# Altium project Structure_stend.PrjPcb
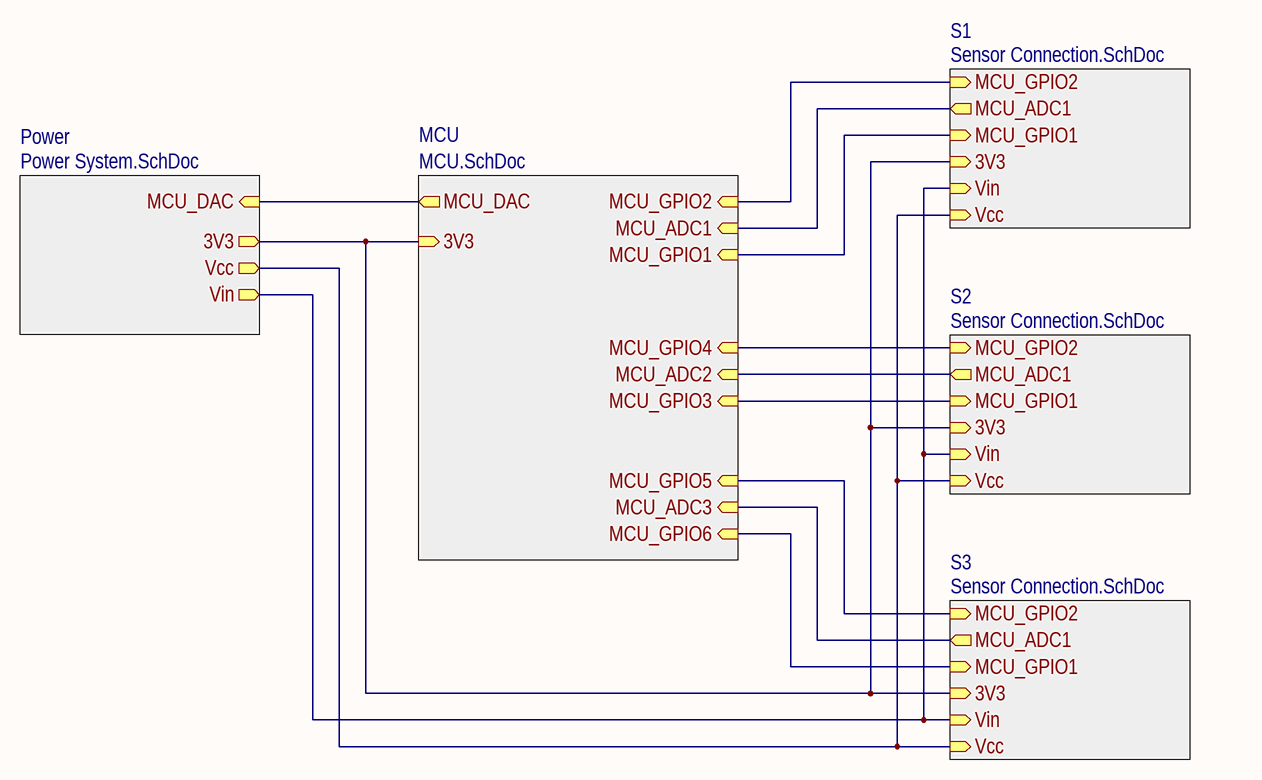
[diagram p0: Stucture.SchDoc]
4 sheets, 100 parts. Net scope: hierarchical (ports join the sheet entries above them; power ports are global).
Board file: VISUR-stend.1.PcbDoc
Sheets:
  Stucture.SchDoc
    MCU = MCU.SchDoc
    Power = Power System.SchDoc
    S1 = Sensor Connection.SchDoc
    S2 = Sensor Connection.SchDoc
    S3 = Sensor Connection.SchDoc

## Sheet Stucture.SchDoc
size 420 x 297 mm; Address1: Address1; Address2: Address2; Address3: Address3; Address4: Address4; DocumentNumber: АБВГ.123456.001 Э3; SheetNumber: 1; Scale: 1:1; DocumentType: Схема электрическая принципиальная; FirstReferrence: АБВГ.123456.001

### Sub-sheets
MCU = MCU.SchDoc: MCU_GPIO5 (in), MCU_GPIO6 (in), MCU_GPIO4 (in), MCU_ADC3 (in), MCU_GPIO1 (in), MCU_ADC1 (in), MCU_ADC2 (in), MCU_DAC (out), 3V3 (in), MCU_GPIO2 (in), MCU_GPIO3 (in)
Power = Power System.SchDoc: MCU_DAC (in), Vcc (out), 3V3 (out), Vin (out)
S1 = Sensor Connection.SchDoc: MCU_GPIO2 (in), MCU_ADC1 (out), MCU_GPIO1 (in), Vcc (in), 3V3 (in), Vin (in)
S2 = Sensor Connection.SchDoc: MCU_GPIO2 (in), MCU_ADC1 (out), MCU_GPIO1 (in), Vcc (in), 3V3 (in), Vin (in)
S3 = Sensor Connection.SchDoc: MCU_GPIO2 (in), MCU_ADC1 (out), MCU_GPIO1 (in), Vcc (in), 3V3 (in), Vin (in)

### Nets
3V3: sheet MCU/3V3, sheet Power/3V3, sheet S1/3V3, sheet S2/3V3, sheet S3/3V3
Vin: sheet Power/Vin, sheet S1/Vin, sheet S2/Vin, sheet S3/Vin
NetC5_2: sheet Power/Vcc, sheet S1/Vcc, sheet S2/Vcc, sheet S3/Vcc
NetDA1_S1_1: sheet MCU/MCU_ADC1, sheet S1/MCU_ADC1
NetDA1_S2_1: sheet MCU/MCU_ADC2, sheet S2/MCU_ADC1
NetDA1_S3_1: sheet MCU/MCU_ADC3, sheet S3/MCU_ADC1
NetDD7_10: sheet MCU/MCU_DAC, sheet Power/MCU_DAC
NetDD7_17: sheet MCU/MCU_GPIO6, sheet S3/MCU_GPIO1
NetDD7_18: sheet MCU/MCU_GPIO5, sheet S3/MCU_GPIO2
NetDD7_19: sheet MCU/MCU_GPIO4, sheet S2/MCU_GPIO2
NetDD7_20: sheet MCU/MCU_GPIO3, sheet S2/MCU_GPIO1
NetDD7_21: sheet MCU/MCU_GPIO2, sheet S1/MCU_GPIO2
NetDD7_22: sheet MCU/MCU_GPIO1, sheet S1/MCU_GPIO1

### Notes on the sheet
- Перв. примен.
- Справ. №
- Подп. и дата
- Инв. № дубл.
- Взам. инв. №
- Разраб.
- Изм.
- Лист
- № докум.
- Подп.
- Дата
- Лит.
- Масса
- Масштаб
- Пров.
- Т.контр.
- Листов
- Инв. № подл.
- Утв.
- Н.контр.
- 2.106-A3
- Копировал
- Формат А3

## Sheet MCU.SchDoc
size 420 x 297 mm; Address1: Address1; Address2: Address2; Address3: Address3; Address4: Address4; DocumentNumber: АБВГ.123456.001 Э3; SheetNumber: 1; Scale: 1:1; DocumentType: Схема электрическая принципиальная; FirstReferrence: АБВГ.123456.001
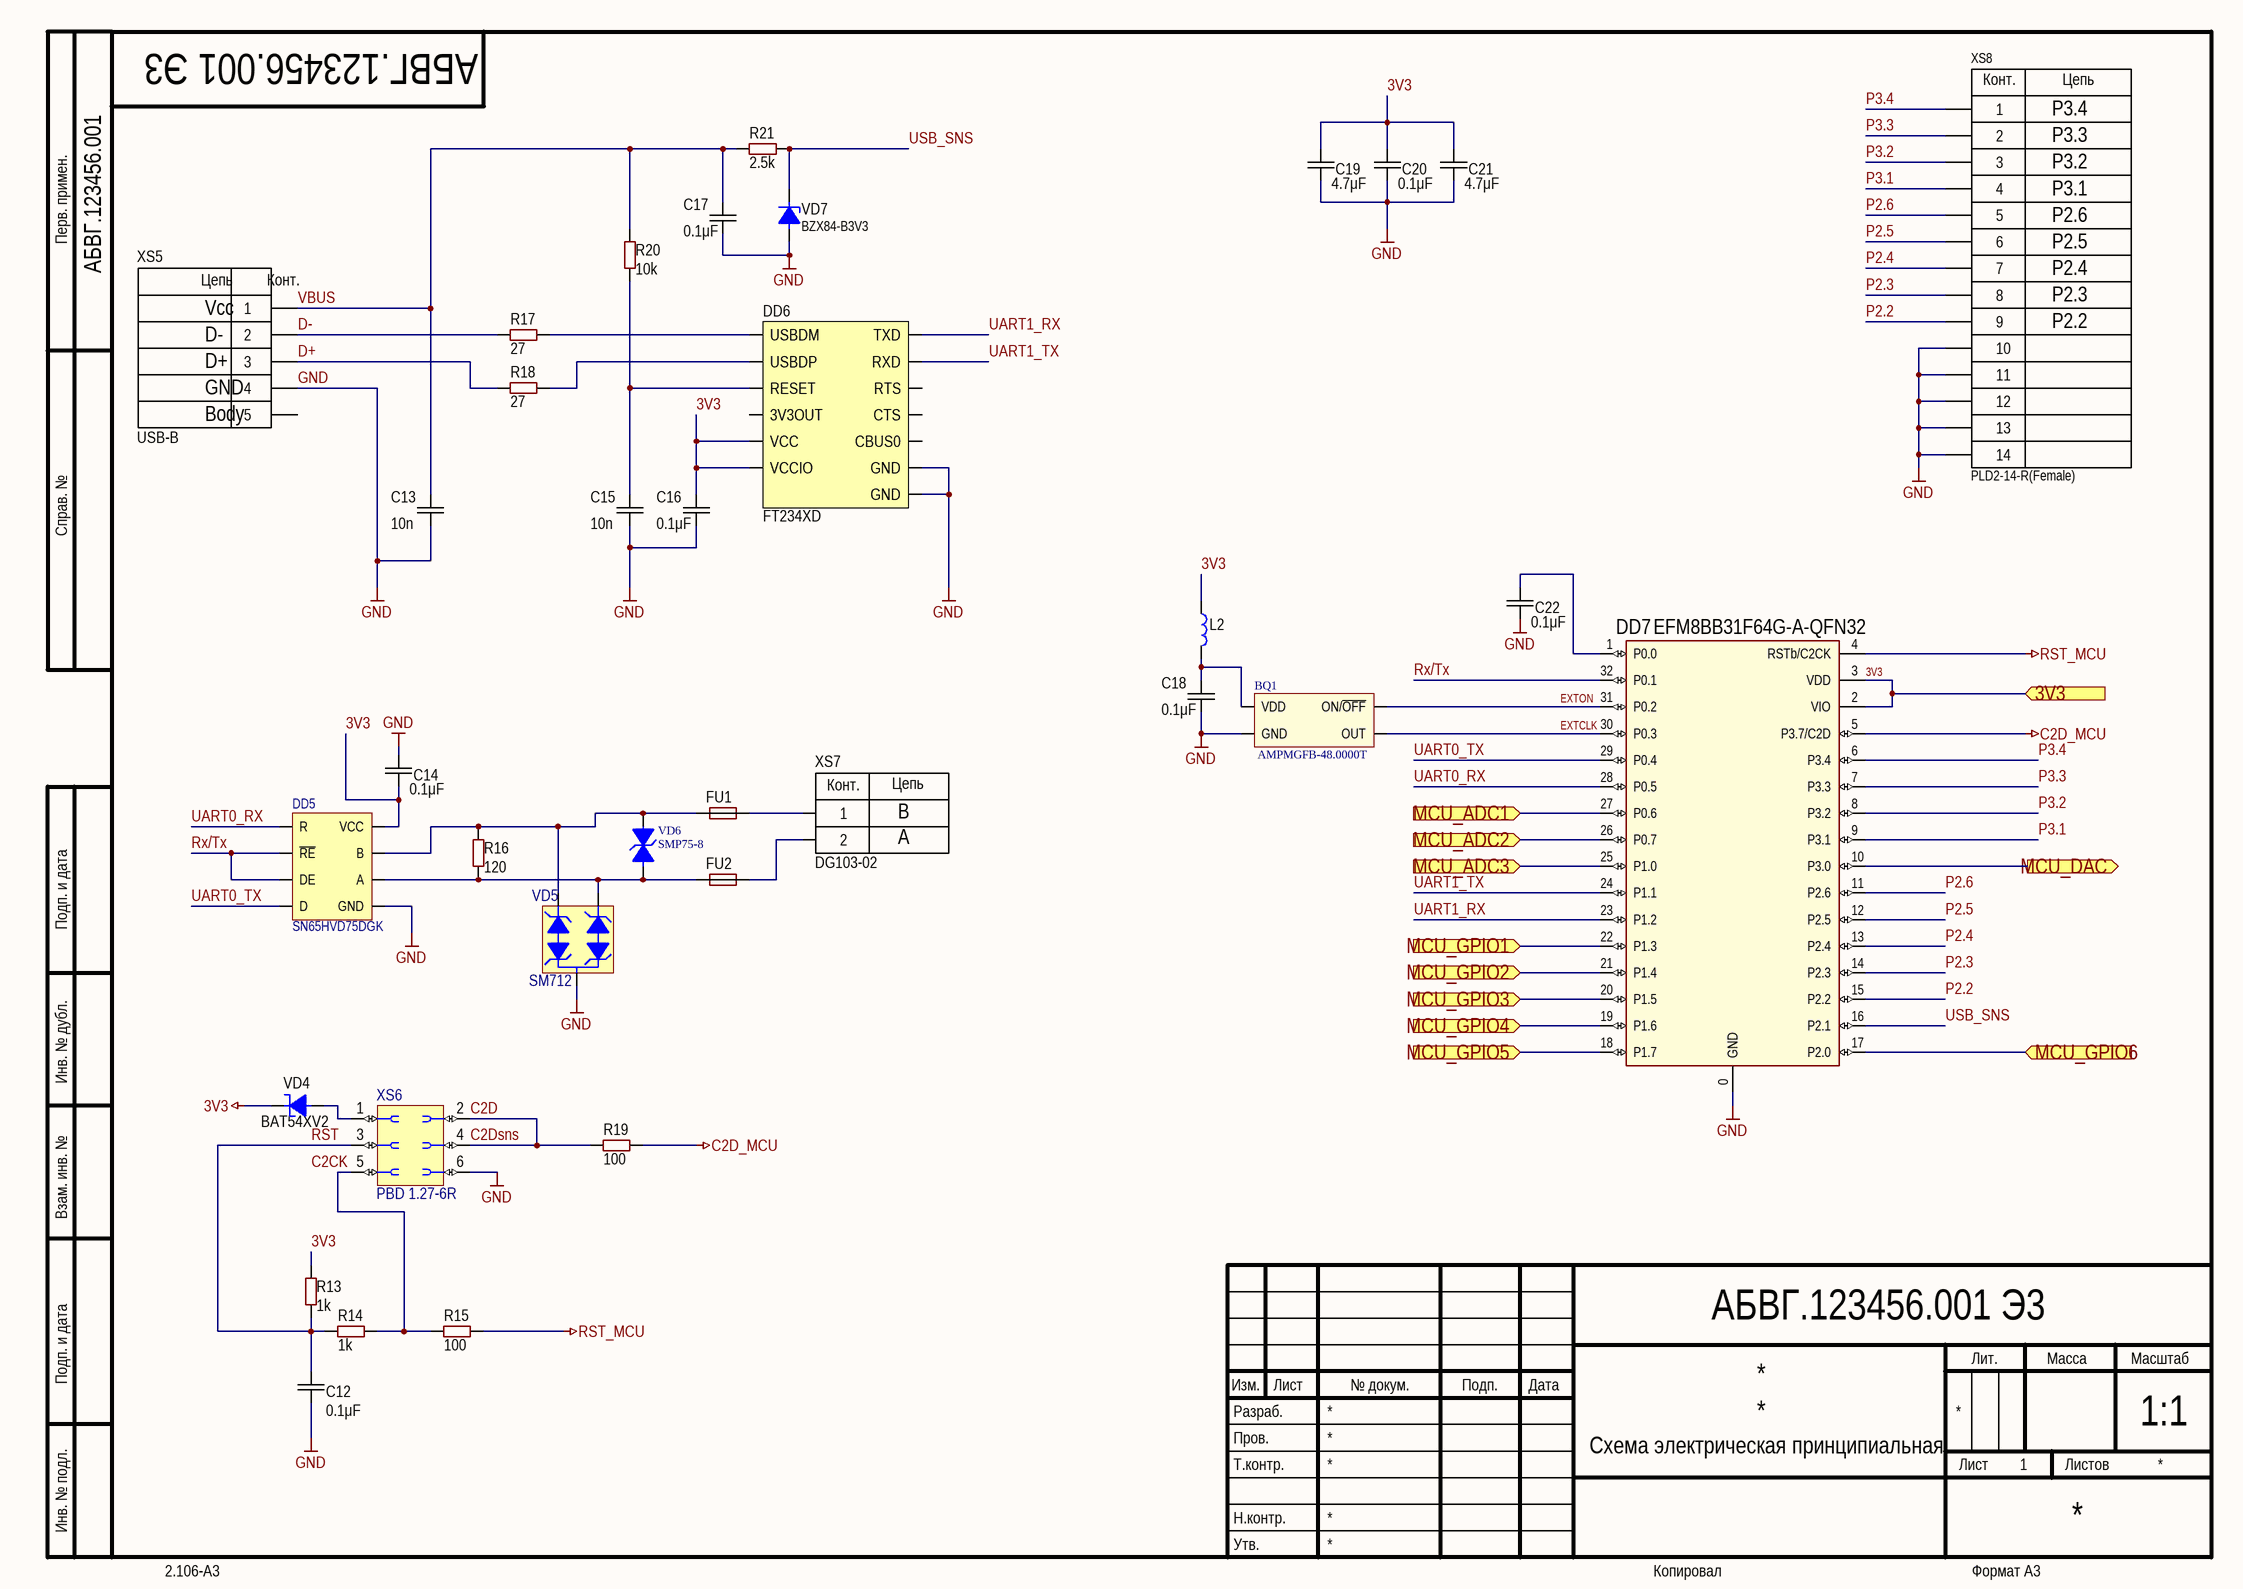
[diagram p1: MCU.SchDoc]

### Parts
BQ1  AMPMGFB-48.0000T  [AMPMGFB(1.6x1.2)]
C12  value 0.1μF  [CAP: 0603]
C13  value 10n  [CAP: 0603]
C14  value 0.1μF  [CAP: 0603]
C15  value 10n  [CAP: 0603]
C16  value 0.1μF  [CAP: 0603]
C17  value 0.1μF  [CAP: 0603]
C18  value 0.1μF  [CAP: 0603]
C19  value 4.7μF  [CAP: 0603]
C20  value 0.1μF  [CAP: 0603]
C21  value 4.7μF  [CAP: 0603]
C22  value 0.1μF  [CAP: 0603]
DD5  SN65HVD75DGK  [VSSOP-8]
DD6  FT234XD  [12-DFN]
DD7  EFM8BB31F64G-A-QFN32  [32-QFN(4x4)]
FU1  (no value)  [FUSE: 0603]
FU2  (no value)  [FUSE: 0603]
L2  BLM18AG102SN1D  [IND: 0603]  (value not drawn)
R13  value 1k  [RES: 0603]
R14  value 1k  [RES: 0603]
R15  value 100  [RES: 0603]
R16  value 120  [RES: 0603]
R17  value 27  [RES: 0603]
R18  value 27  [RES: 0603]
R19  value 100  [RES: 0603]
R20  value 10k  [RES: 0603]
R21  value 2.5k  [RES: 0603]
VD4  PartNumber: BAT54XV2  [DIODE: SOD523]
VD5  SM712  [SOT23]
VD6  SMP75-8  [DIODE: SMB]
VD7  BZX84-B3V3  [SOT23]
XS5  USB-B  [CON: USB-B(Female vertical)]
XS6  PBD 1.27-6R  [CON: PLLD-6R(1.27)]
XS7  DG103-02  [DG103-02]
XS8  PLD2-14-R(Female)  [CON: PLD2-14-R(Female)]

### Ports
3V3 (in), MCU_ADC1 (in), MCU_ADC2 (in), MCU_ADC3 (in), MCU_DAC (out), MCU_GPIO1 (in), MCU_GPIO2 (in), MCU_GPIO3 (in), MCU_GPIO4 (in), MCU_GPIO5 (in), MCU_GPIO6 (in)

### Nets
3V3: C14.1 C16.2 C19.2 C20.2 C21.2 DD5.8(VCC) DD6.4(VCC) DD6.9(VCCIO) DD7.2(VIO) DD7.3(VDD) L2.1 R13.1 VD4.2 ; port 3V3
C2D_MCU: DD7.5(P3.7/C2D) R19.1
GND: BQ1.2(GND) C12.1 C13.1 C14.2 C15.1 C16.1 C17.1 C18.1 C19.1 C20.1 C21.1 C22.1 DD5.5(GND) DD6.5(GND) DD6.13(GND) DD7.0(GND) VD5.3 VD7.1 XS5.4 XS6.6 XS8.10 XS8.11 XS8.12 XS8.13 XS8.14
RST_MCU: DD7.4(RSTb/C2CK) R15.2
C2D: R19.2 XS6.2 XS6.4  [also labelled C2Dsns]
D+: R18.2 XS5.3
D-: R17.2 XS5.2
EXTCLK: BQ1.3(OUT) DD7.30(P0.3)
EXTON: BQ1.1(ON/~{OFF}) DD7.31(P0.2)
P2.2: DD7.15(P2.2) XS8.9
P2.3: DD7.14(P2.3) XS8.8
P2.4: DD7.13(P2.4) XS8.7
P2.5: DD7.12(P2.5) XS8.6
P2.6: DD7.11(P2.6) XS8.5
P3.1: DD7.9(P3.1) XS8.4
P3.2: DD7.8(P3.2) XS8.3
P3.3: DD7.7(P3.3) XS8.2
P3.4: DD7.6(P3.4) XS8.1
RST: C12.2 R13.2 R14.1 XS6.3
Rx/Tx: DD5.2(~{RE}) DD5.3(DE) DD7.32(P0.1)
UART0_RX: DD5.1(R) DD7.28(P0.5)
UART0_TX: DD5.4(D) DD7.29(P0.4)
UART1_RX: DD6.7(TXD) DD7.23(P1.2)
UART1_TX: DD6.10(RXD) DD7.24(P1.1)
USB_SNS: DD7.16(P2.1) R21.1 VD7.2
VBUS: C13.2 C17.2 R20.2 R21.2 XS5.1
NetBQ1_4: BQ1.4(VDD) C18.2 L2.2
NetC15_2: C15.2 DD6.2(RESET) R20.1
NetC22_2: C22.2 DD7.1(P0.0)
NetDA1_S1_1: DD7.27(P0.6) ; port MCU_ADC1
NetDA1_S2_1: DD7.26(P0.7) ; port MCU_ADC2
NetDA1_S3_1: DD7.25(P1.0) ; port MCU_ADC3
NetDD5_6: DD5.6(A) FU2.1 R16.1 VD5.2 VD6.1
NetDD5_7: DD5.7(B) FU1.1 R16.2 VD5.1 VD6.2
NetDD6_1: DD6.1(USBDM) R17.1
NetDD6_12: DD6.12(USBDP) R18.1
NetDD7_10: DD7.10(P3.0) ; port MCU_DAC
NetDD7_17: DD7.17(P2.0) ; port MCU_GPIO6
NetDD7_18: DD7.18(P1.7) ; port MCU_GPIO5
NetDD7_19: DD7.19(P1.6) ; port MCU_GPIO4
NetDD7_20: DD7.20(P1.5) ; port MCU_GPIO3
NetDD7_21: DD7.21(P1.4) ; port MCU_GPIO2
NetDD7_22: DD7.22(P1.3) ; port MCU_GPIO1
NetFU1_2: FU1.2 XS7.1
NetFU2_2: FU2.2 XS7.2
NetR14_2: R14.2 R15.1 XS6.5
NetVD4_1: VD4.1 XS6.1

Not connected (* = marked no-connect by the designer): DD6 3(3V3OUT) 6(CBUS0) 8(RTS) 11(CTS); XS5 5

### Notes on the sheet
- P3.4
- P3.2
- P3.3
- P2.5
- P2.6
- P3.1
- P2.2
- P2.3
- P2.4
- B
- A
- Labels drawn without touching a wire or pin: C2CK
- Перв. примен.
- Справ. №
- Подп. и дата
- Инв. № дубл.
- Взам. инв. №
- Разраб.
- Изм.
- Лист
- № докум.
- Подп.
- Дата
- Лит.
- Масса
- Масштаб
- Пров.
- Т.контр.
- Листов
- Инв. № подл.
- Утв.
- Н.контр.
- 2.106-A3
- Копировал
- Формат А3
- (in symbol DG103-02) Конт.; Цепь
- (in symbol PLD2-14(Female)) Конт.; Цепь
- (in symbol USB-B) Цепь; Конт.; Vcc; D-; D+; GND; Body

### Library data of the parts
C12 C14 C16-C18 C20 C22 = Ceramic_0603: Manufacturer: Yageo; PartNumber: CC0603KRX7R7BB104; ValueManufacturerPartNumber: Ceramic capacitor, 0.1μF, X7R, ±10%, 16V, 0603, -55...+125°C; TypeCapacitor: Ceramic capacitor; Tolerance: ±10%; TypeDielectric: X7R; Voltage: 16V; Package: 0603; HelpURL: https://www.digikey.com/product-detail/en/yageo/CC0603KRX7R7BB104/311-1088-1-ND/302998; Temperature: -55...+125°C
C13 C15 = Ceramic_0603: Manufacturer: Yageo; PartNumber: CC0603KRX7R7BB104; ValueManufacturerPartNumber: Ceramic capacitor, 10n, X7R, ±10%, 16V, 0603, -55...+125°C; TypeCapacitor: Ceramic capacitor; Tolerance: ±10%; TypeDielectric: X7R; Voltage: 16V; Package: 0603; HelpURL: https://www.digikey.com/product-detail/en/yageo/CC0603KRX7R7BB104/311-1088-1-ND/302998; Temperature: -55...+125°C
C19 C21 = Ceramic_0603: Manufacturer: Yageo; PartNumber: CC0603KRX7R7BB104; ValueManufacturerPartNumber: Ceramic capacitor, 4.7μF, X7R, ±10%, 16V, 0603, -55...+125°C; TypeCapacitor: Ceramic capacitor; Tolerance: ±10%; TypeDielectric: X7R; Voltage: 16V; Package: 0603; HelpURL: https://www.digikey.com/product-detail/en/yageo/CC0603KRX7R7BB104/311-1088-1-ND/302998; Temperature: -55...+125°C
DD5 = SN65HVD72DGK: RS-485/422; ComponentLink1Description: Datasheet; ComponentLink1URL: https://www.ti.com/lit/ds/symlink/sn65hvd72.pdf?ts=1607084930164&ref_url=https%253A%252F%252Fwww.ti.com%252Fstore%252Fti%252Fen%252Fp%252Fproduct%252F%253Fp%253DSN65HVD72DRBT
DD6 = FT234XD: USB-UART; ComponentLink1Description: Datasheet; ComponentLink1URL: https://ftdichip.com/wp-content/uploads/2020/08/DS_FT234XD.pdf
DD7 = EFM8BB31F64G-A-QFN32: 8051 MCU Core
FU1 FU2 = Fuse: Manufacturer: Littelfuse; PartNumber: 01110501Z; TypeFuse: Electromechanics relay; VoltageMax: 250VAC; Package: 5x20mm; HelpURL: https://www.digikey.com/products/en?keywords=01110501Z; ValueManufacturerPartNumber: =TypeFuse+', '+VoltageMax+', '+MaxCurrent+', '+Package+', '+Temperature
L2 = BLM18AG102SN1D: 100MHz 1K
R13 R14 = Resistor_0603: Manufacturer: Yageo; PartNumber: RC0603JR-07100RL; ValueManufacturerPartNumber: Resistor film, 1k, ±5%, 0603, 0.1W, -55...+125°C; TypeResistor: Resistor film; Power: 0.1W; Tolerance: ±5%; Package: 0603; HelpURL: https://www.digikey.com/product-detail/en/yageo/RC0603JR-07100RL/311-100GRCT-ND/729644; Temperature: -55...+125°C
R15 R19 = Resistor_0603: Manufacturer: Yageo; PartNumber: RC0603JR-07100RL; ValueManufacturerPartNumber: Resistor film, 100, ±5%, 0603, 0.1W, -55...+125°C; TypeResistor: Resistor film; Power: 0.1W; Tolerance: ±5%; Package: 0603; HelpURL: https://www.digikey.com/product-detail/en/yageo/RC0603JR-07100RL/311-100GRCT-ND/729644; Temperature: -55...+125°C
R16 = Resistor_0603: Manufacturer: Yageo; PartNumber: RC0603JR-07100RL; ValueManufacturerPartNumber: Resistor film, 120, ±5%, 0603, 0.1W, -55...+125°C; TypeResistor: Resistor film; Power: 0.1W; Tolerance: ±5%; Package: 0603; HelpURL: https://www.digikey.com/product-detail/en/yageo/RC0603JR-07100RL/311-100GRCT-ND/729644; Temperature: -55...+125°C
R17 R18 = Resistor_0603: Manufacturer: Yageo; PartNumber: RC0603JR-07100RL; ValueManufacturerPartNumber: Resistor film, 27, ±5%, 0603, 0.1W, -55...+125°C; TypeResistor: Resistor film; Power: 0.1W; Tolerance: ±5%; Package: 0603; HelpURL: https://www.digikey.com/product-detail/en/yageo/RC0603JR-07100RL/311-100GRCT-ND/729644; Temperature: -55...+125°C
R20 = Resistor_0603: Manufacturer: Yageo; PartNumber: RC0603JR-07100RL; ValueManufacturerPartNumber: Resistor film, 10k, ±5%, 0603, 0.1W, -55...+125°C; TypeResistor: Resistor film; Power: 0.1W; Tolerance: ±5%; Package: 0603; HelpURL: https://www.digikey.com/product-detail/en/yageo/RC0603JR-07100RL/311-100GRCT-ND/729644; Temperature: -55...+125°C
R21 = Resistor_0603: Manufacturer: Yageo; PartNumber: RC0603JR-07100RL; ValueManufacturerPartNumber: Resistor film, 2.5k, ±5%, 0603, 0.1W, -55...+125°C; TypeResistor: Resistor film; Power: 0.1W; Tolerance: ±5%; Package: 0603; HelpURL: https://www.digikey.com/product-detail/en/yageo/RC0603JR-07100RL/311-100GRCT-ND/729644; Temperature: -55...+125°C
VD4 = Schottky_single: Manufacturer: Diodes Incorporated; ValueManufacturerPartNumber: Schottky diode, 80V, 500mA, 1V, 15pF, SOD-123, -55...+150°C; TypeDiode: Schottky diode; Voltage: 80V; Current: 500mA; VoltageDrop: 1V; RecoveryTime: 15pF; Package: SOD-123; HelpURL: https://www.digikey.com/product-detail/en/diodes-incorporated/MBR0580S1-7/MBR0580S1-7DICT-ND/5080371; Temperature: -55...+150°C
VD5 = SM712: EIA RS-485 ±7V ±12V
VD6 = SMBJ10CA-TR
XS8 = PLD2-14(Female): ComponentLink1Description: Datasheet; ComponentLink1URL: https://www.compel.ru/item-pdf/1e1366ded138976aeb89dd182fa987b9/ps/kls~kls1-207b.pdf
VD7 = BZX84-B3V3: ComponentLink1Description: Datasheet; ComponentLink1URL: https://www.nexperia.com/products/diodes/automotive-diodes/automotive-zener-diodes/BZX84-B3V3.html
XS5 = USB-B: ComponentLink1Description: Datasheet; ComponentLink1URL: https://www.sparkfun.com/datasheets/Prototyping/USB-B%20Connector.pdf; ComponentLink2Description: Datasheet(vertical); ComponentLink2URL: https://app.adam-tech.com/products/download/data_sheet/195855/usb-b-s-vt-data-sheet.pdf

## Sheet Power System.SchDoc
size 420 x 297 mm; Address1: Address1; Address2: Address2; Address3: Address3; Address4: Address4; DocumentNumber: АБВГ.123456.001 Э3; SheetNumber: 1; Scale: 1:1; DocumentType: Схема электрическая принципиальная; FirstReferrence: АБВГ.123456.001
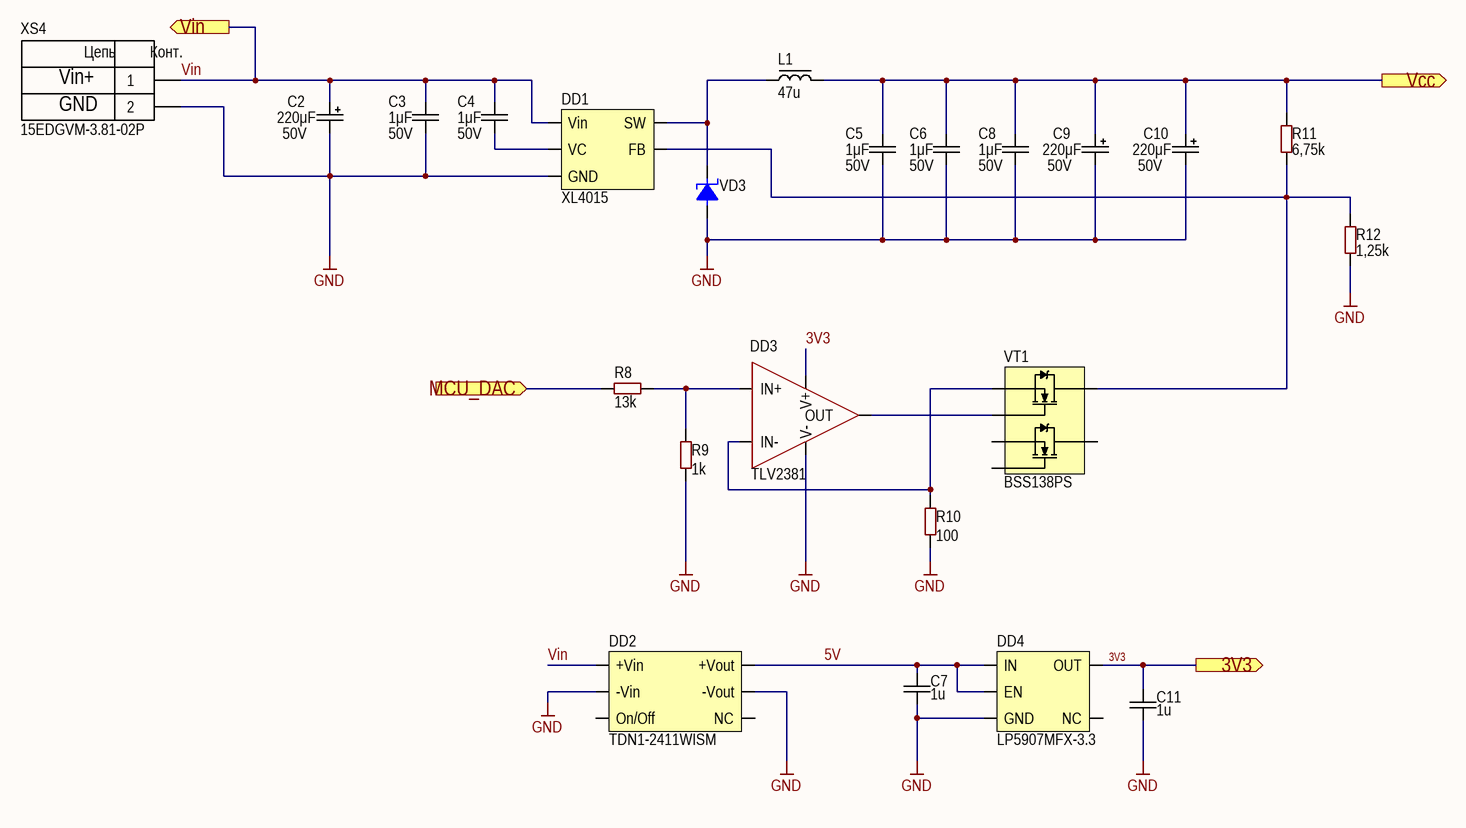
[diagram p2: Power System.SchDoc]

### Parts
C2  value 220μF  Voltage: 50V  [CAP: SMD-G Package(10x10)]
C3  value 1μF  Voltage: 50V  [CAP: 0805]
C4  value 1μF  Voltage: 50V  [CAP: 0805]
C5  value 1μF  Voltage: 50V  [CAP: 0805]
C6  value 1μF  Voltage: 50V  [CAP: 0805]
C7  value 1u  [CAP: 0603]
C8  value 1μF  Voltage: 50V  [CAP: 0805]
C9  value 220μF  Voltage: 50V  [CAP: SMD-G Package(10x10)]
C10  value 220μF  Voltage: 50V  [CAP: SMD-G Package(10x10)]
C11  value 1u  [CAP: 0603]
DD1  XL4015  [TO263-5L]
DD2  TDN1-2411WISM  [TDN1-2411WISM]
DD3  TLV2381  [SOT23-5]
DD4  LP5907MFX-3.3  [SOT23-5]
L1  47u  [IND: HM]
R8  value 13k  [RES: 0603]
R9  value 1k  [RES: 0603]
R10  value 100  [RES: 0603]
R11  value 6,75k  [RES: 0603]
R12  value 1,25k  [RES: 0603]
VD3  STPS1045DEE  [PowerFLAT(3.3x3.3)]  (value not drawn)
VT1  BSS138PS  [SOT363]
XS4  15EDGVM-3.81-02P  [CON: 15EDGVM-3.81-02P]

### Ports
3V3 (out), MCU_DAC (in), Vcc (out), Vin (out)

### Nets
3V3: C11.2 DD3.5(V+) DD4.5(OUT) ; port 3V3
GND: C2.2 C3.1 C5.1 C6.1 C7.1 C8.1 C9.2 C10.2 C11.1 DD1.1(GND) DD2.2(-Vin) DD2.6(-Vout) DD3.2(V-) DD4.2(GND) R9.2 R10.2 R12.1 VD3.1 XS4.2
5V: C7.2 DD2.7(+Vout) DD4.1(IN) DD4.3(EN)
Vin: C2.1 C3.2 C4.2 DD1.5(Vin) DD2.1(+Vin) XS4.1 ; port Vin
NetC4_1: C4.1 DD1.4(VC)
NetC5_2: C5.2 C6.2 C8.2 C9.1 C10.1 L1.2 R11.2 ; port Vcc
NetDD1_2: DD1.2(FB) R11.1 R12.2 VT1.6(D1)
NetDD1_3: DD1.3(SW) L1.1 VD3.2
NetDD3_1: DD3.1(OUT) VT1.2(G1)
NetDD3_3: DD3.3(IN+) R8.1 R9.1
NetDD3_4: DD3.4(IN-) R10.1 VT1.1(S1)
NetDD7_10: R8.2 ; port MCU_DAC

Not connected (* = marked no-connect by the designer): DD2 4(On/Off) 5(NC); DD4 4(NC); VT1 3(D2) 4(S2) 5(G2)

### Notes on the sheet
- (near XS4) Vin+
- GND
- Перв. примен.
- Справ. №
- Подп. и дата
- Инв. № дубл.
- Взам. инв. №
- Разраб.
- Изм.
- Лист
- № докум.
- Подп.
- Дата
- Лит.
- Масса
- Масштаб
- Пров.
- Т.контр.
- Листов
- Инв. № подл.
- Утв.
- Н.контр.
- 2.106-A3
- Копировал
- Формат А3
- (in symbol 15EDGVM-3.81-02P) Цепь; Конт.

### Library data of the parts
C2 C9 C10 = Aluminium
C3-C6 C8 = Ceramic_0805: Manufacturer: Yageo; PartNumber: CC0805KRX7R7BB104; ValueManufacturerPartNumber: Ceramic capacitor, 1μF, X7R, ±10%, 50V, 0805, -55...+125°C; TypeCapacitor: Ceramic capacitor; Tolerance: ±10%; TypeDielectric: X7R; Package: 0805; HelpURL: https://www.digikey.com/product-detail/en/yageo/CC0805KRX7R7BB104/311-1142-1-ND/303052; Temperature: -55...+125°C
C7 C11 = Ceramic_0603: Manufacturer: Yageo; PartNumber: CC0603KRX7R7BB104; ValueManufacturerPartNumber: Ceramic capacitor, 1u, X7R, ±10%, 16V, 0603, -55...+125°C; TypeCapacitor: Ceramic capacitor; Tolerance: ±10%; TypeDielectric: X7R; Voltage: 16V; Package: 0603; HelpURL: https://www.digikey.com/product-detail/en/yageo/CC0603KRX7R7BB104/311-1088-1-ND/302998; Temperature: -55...+125°C
DD1 = XL4015: Buck DC-DC; ComponentLink1Description: Datasheet; ComponentLink1URL: http://www.xlsemi.com/datasheet/xl4015%20datasheet.pdf
DD2 = TDN1-2411WISM: DC-DC converter; ComponentLink1Description: Datasheet; ComponentLink1URL: https://www.tracopower.com/int/ru/model/tdn-1-2411wism
DD3 = TLV2381: OPAmp; ComponentLink1Description: Datasheet; ComponentLink1URL: https://www.ti.com/lit/ds/symlink/tlv2382.pdf?ts=1631189776503&ref_url=https%253A%252F%252Fwww.google.com%252F
DD4 = LP5907MFX-3.3: LDO 250 mA; ComponentLink1Description: Datasheet; ComponentLink1URL: https://www.ti.com/lit/ds/symlink/lp5907.pdf?ts=1629438025263&ref_url=https%253A%252F%252Fwww.google.com%252F
L1 = Inductor(HM)
R8 = Resistor_0603: Manufacturer: Yageo; PartNumber: RC0603JR-07100RL; ValueManufacturerPartNumber: Resistor film, 13k, ±5%, 0603, 0.1W, -55...+125°C; TypeResistor: Resistor film; Power: 0.1W; Tolerance: ±5%; Package: 0603; HelpURL: https://www.digikey.com/product-detail/en/yageo/RC0603JR-07100RL/311-100GRCT-ND/729644; Temperature: -55...+125°C
R9 = Resistor_0603: as R13 on sheet MCU; Package: 0603; HelpURL: https://www.digikey.com/product-detail/en/yageo/RC0603JR-07100RL/311-100GRCT-ND/729644; Temperature: -55...+125°C
R10 = Resistor_0603: as R15 on sheet MCU; Package: 0603; HelpURL: https://www.digikey.com/product-detail/en/yageo/RC0603JR-07100RL/311-100GRCT-ND/729644; Temperature: -55...+125°C
R11 = Resistor_0603: Manufacturer: Yageo; PartNumber: RC0603JR-07100RL; ValueManufacturerPartNumber: Resistor film, 6,75k, ±5%, 0603, 0.1W, -55...+125°C; TypeResistor: Resistor film; Power: 0.1W; Tolerance: ±5%; Package: 0603; HelpURL: https://www.digikey.com/product-detail/en/yageo/RC0603JR-07100RL/311-100GRCT-ND/729644; Temperature: -55...+125°C
R12 = Resistor_0603: Manufacturer: Yageo; PartNumber: RC0603JR-07100RL; ValueManufacturerPartNumber: Resistor film, 1,25k, ±5%, 0603, 0.1W, -55...+125°C; TypeResistor: Resistor film; Power: 0.1W; Tolerance: ±5%; Package: 0603; HelpURL: https://www.digikey.com/product-detail/en/yageo/RC0603JR-07100RL/311-100GRCT-ND/729644; Temperature: -55...+125°C
VD3 = STPS1045DEE: 45V,10A Schottky; ComponentLink1Description: Datasheet; ComponentLink1URL: https://www.st.com/en/diodes-and-rectifiers/stps1045dee.html
VT1 = BSS138PS: ComponentLink1Description: Datasheet; ComponentLink1URL: https://assets.nexperia.com/documents/data-sheet/BSS138PS.pdf
XS4 = 15EDGVM-3.81-02P: ComponentLink1Description: Datasheet; ComponentLink1URL: http://files.xn--e1agecchai.xn--p1ai/pdf/15edgvm-3.81.pdf

## Sheet Sensor Connection.SchDoc
size 420 x 297 mm; Address1: Address1; Address2: Address2; Address3: Address3; Address4: Address4; DocumentNumber: АБВГ.123456.001 Э3; SheetNumber: 1; Scale: 1:1; DocumentType: Схема электрическая принципиальная; FirstReferrence: АБВГ.123456.001
Used 3 times, as channels S1, S2, S3. Parts and nets are listed once, with the designators drawn on the sheet.
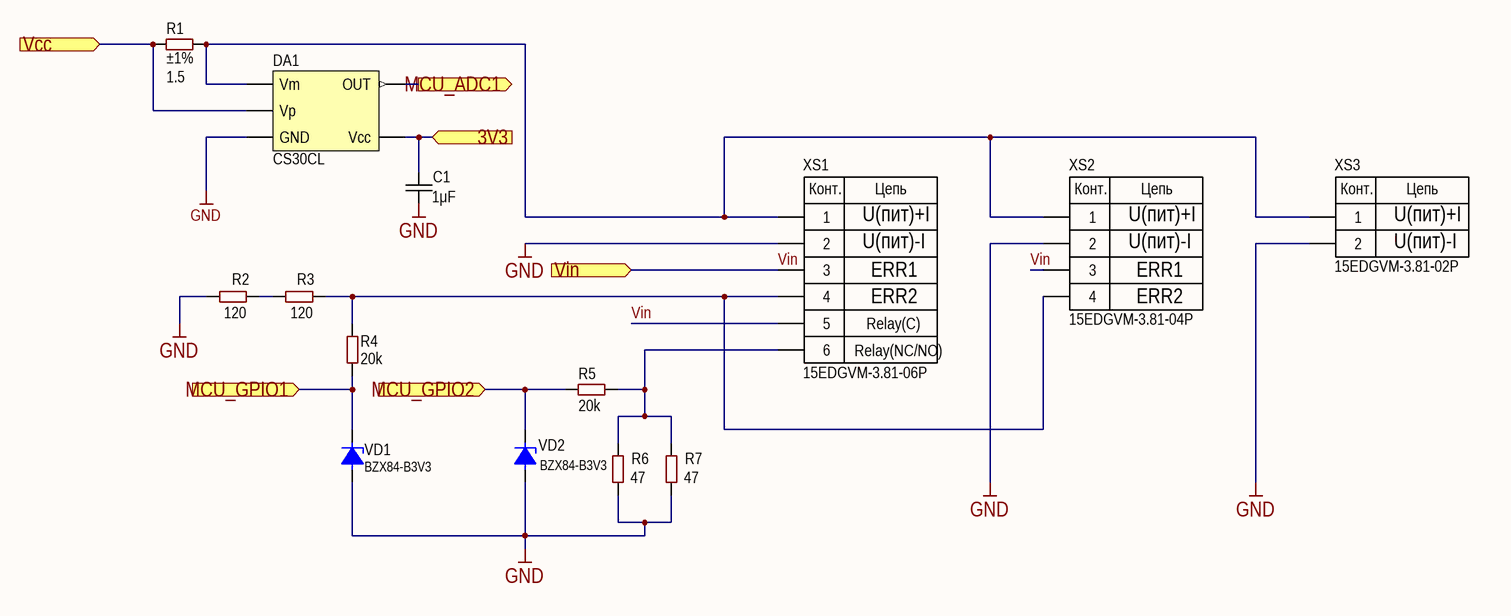
[diagram p3: Sensor Connection.SchDoc]

### Parts
C1  value 1μF  [CAP: 0603]
DA1  CS30CL  [SOT23-5]
R1  value 1.5  Tolerance: ±1%  [RES: 2512]
R2  120  [MFR-2W]
R3  120  [MFR-2W]
R4  value 20k  [RES: 0603]
R5  value 20k  [RES: 0603]
R6  47  [SQP-10]
R7  47  [SQP-10]
VD1  BZX84-B3V3  [SOT23]
VD2  BZX84-B3V3  [SOT23]
XS1  15EDGVM-3.81-06P  [CON: 15EDGVM-3.81-06P]
XS2  15EDGVM-3.81-04P  [CON: 15EDGVM-3.81-04P]
XS3  15EDGVM-3.81-02P  [CON: 15EDGVM-3.81-02P]

### Ports
3V3 (in), MCU_ADC1 (out), MCU_GPIO1 (in), MCU_GPIO2 (in), Vcc (in), Vin (in)

### Nets
GND: C1.1 DA1.2(GND) R2.1 R6.1 R7.1 VD1.1 VD2.1 XS1.2 XS2.2 XS3.2
3V3: C1.2 DA1.5(Vcc) ; port 3V3
MCU_ADC1: DA1.1(OUT) ; port MCU_ADC1
MCU_GPIO1: R4.1 VD1.2 ; port MCU_GPIO1
MCU_GPIO2: R5.1 VD2.2 ; port MCU_GPIO2
Vcc: DA1.3(Vp) R1.1 ; port Vcc
Vin: XS1.3 XS1.5 XS2.3 ; port Vin
NetDA1_4: DA1.4(Vm) R1.2 XS1.1 XS2.1 XS3.1
NetR2_2: R2.2 R3.1
NetR3_2: R3.2 R4.2 XS1.4 XS2.4
NetR5_2: R5.2 R6.2 R7.2 XS1.6

### Channels
S1: designators end in _S1; ports 3V3=3V3 MCU_ADC1=NetDA1_S1_1 MCU_GPIO1=NetDD7_22 MCU_GPIO2=NetDD7_21 Vcc=NetC5_2 Vin=Vin
S2: designators end in _S2; ports 3V3=3V3 MCU_ADC1=NetDA1_S2_1 MCU_GPIO1=NetDD7_20 MCU_GPIO2=NetDD7_19 Vcc=NetC5_2 Vin=Vin
S3: designators end in _S3; ports 3V3=3V3 MCU_ADC1=NetDA1_S3_1 MCU_GPIO1=NetDD7_17 MCU_GPIO2=NetDD7_18 Vcc=NetC5_2 Vin=Vin

### Notes on the sheet
- U(пит)+I
- U(пит)-I
- ERR1
- ERR2
- Двухватные резисторы,
  выделяется по 1.2 Вата на каждом.
- (near XS1) Relay(NC/NO)
- Relay(C)
- (near VD1) Десятиватные резисторы,
  Выделяется примерно по 12 Вт на каждом
- Перв. примен.
- Справ. №
- Подп. и дата
- Инв. № дубл.
- Взам. инв. №
- Разраб.
- Изм.
- Лист
- № докум.
- Подп.
- Дата
- Лит.
- Масса
- Масштаб
- Пров.
- Т.контр.
- Листов
- Инв. № подл.
- Утв.
- Н.контр.
- 2.106-A3
- Копировал
- Формат А3
- (in symbol 15EDGVM-3.81-02P) Конт.; Цепь
- (in symbol 15EDGVM-3.81-04P) Конт.; Цепь
- (in symbol 15EDGVM-3.81-06P) Конт.; Цепь

### Library data of the parts
C1 = Ceramic_0603: Manufacturer: Yageo; PartNumber: CC0603KRX7R7BB104; ValueManufacturerPartNumber: Ceramic capacitor, 1μF, X7R, ±10%, 16V, 0603, -55...+125°C; TypeCapacitor: Ceramic capacitor; Tolerance: ±10%; TypeDielectric: X7R; Voltage: 16V; Package: 0603; HelpURL: https://www.digikey.com/product-detail/en/yageo/CC0603KRX7R7BB104/311-1088-1-ND/302998; Temperature: -55...+125°C
DA1 = CS30CL: High side current sense high voltage op amp; ComponentLink1Description: Datasheet; ComponentLink1URL: https://www.st.com/resource/en/datasheet/cs30.pdf
R1 = Resistor_2512: Manufacturer: Yageo; PartNumber: RC2512JK-07100RL; ValueManufacturerPartNumber: Resistor film, 1.5, ±1%, 2512, 1W, -55...+125°C; TypeResistor: Resistor film; Power: 1W; Package: 2512; HelpURL: https://www.digikey.com/product-detail/en/yageo/RC2512JK-07100RL/YAG3393CT-ND/5962215; Temperature: -55...+125°C
R2 R3 = Resistor_DIP_2W: MFR200JT-73- 120R; ComponentLink1Description: Datasheet; ComponentLink1URL: https://www.yageo.com/upload/media/product/productsearch/datasheet/lr/YAGEO%20MFR_datasheet_2021v0.pdf
R4 R5 = Resistor_0603: Manufacturer: Yageo; PartNumber: RC0603JR-07100RL; ValueManufacturerPartNumber: Resistor film, 20k, ±5%, 0603, 0.1W, -55...+125°C; TypeResistor: Resistor film; Power: 0.1W; Tolerance: ±5%; Package: 0603; HelpURL: https://www.digikey.com/product-detail/en/yageo/RC0603JR-07100RL/311-100GRCT-ND/729644; Temperature: -55...+125°C
R6 R7 = SQP-10W: SQP10AJB-47R; ComponentLink1Description: Datasheet; ComponentLink1URL: https://www.yageo.com/upload/media/product/productsearch/datasheet/lr/YAGEO%20SQP_NSP_datasheet_2021v0.pdf
VD1 VD2 = BZX84-B3V3: ComponentLink1Description: Datasheet; ComponentLink1URL: https://www.nexperia.com/products/diodes/automotive-diodes/automotive-zener-diodes/BZX84-B3V3.html
XS1 = 15EDGVM-3.81-06P: ComponentLink1Description: Datasheet; ComponentLink1URL: https://www.phoenixcontact.com/online/portal/ru/?uri=pxc-oc-itemdetail:pid=1830635&library=&pcck=P-11-02-11&tab=1&selectedCategory=ALL
XS2 = 15EDGVM-3.81-04P: ComponentLink1Description: Datasheet; ComponentLink1URL: http://files.xn--e1agecchai.xn--p1ai/pdf/15edgvm-3.81.pdf
XS3 = 15EDGVM-3.81-02P: ComponentLink1Description: Datasheet; ComponentLink1URL: http://files.xn--e1agecchai.xn--p1ai/pdf/15edgvm-3.81.pdf

## Nets that join several sheets
3V3: MCU (13 pins), Power System (C11.2 DD3.5 DD4.5), S1 (C1_S1.2 DA1_S1.5), S2 (C1_S2.2 DA1_S2.5), S3 (C1_S3.2 DA1_S3.5)
GND: MCU (25 pins), Power System (19 pins), S1 (10 pins), S2 (10 pins), S3 (10 pins)
NetC5_2: Power System (7 pins), S1 (DA1_S1.3 R1_S1.1), S2 (DA1_S2.3 R1_S2.1), S3 (DA1_S3.3 R1_S3.1)
NetDA1_S1_1: MCU (DD7.27), S1 (DA1_S1.1)
NetDA1_S2_1: MCU (DD7.26), S2 (DA1_S2.1)
NetDA1_S3_1: MCU (DD7.25), S3 (DA1_S3.1)
NetDD7_10: MCU (DD7.10), Power System (R8.2)
NetDD7_17: MCU (DD7.17), S3 (R4_S3.1 VD1_S3.2)
NetDD7_18: MCU (DD7.18), S3 (R5_S3.1 VD2_S3.2)
NetDD7_19: MCU (DD7.19), S2 (R5_S2.1 VD2_S2.2)
NetDD7_20: MCU (DD7.20), S2 (R4_S2.1 VD1_S2.2)
NetDD7_21: MCU (DD7.21), S1 (R5_S1.1 VD2_S1.2)
NetDD7_22: MCU (DD7.22), S1 (R4_S1.1 VD1_S1.2)
Vin: Power System (6 pins), S1 (XS1_S1.3 XS1_S1.5 XS2_S1.3), S2 (XS1_S2.3 XS1_S2.5 XS2_S2.3), S3 (XS1_S3.3 XS1_S3.5 XS2_S3.3)